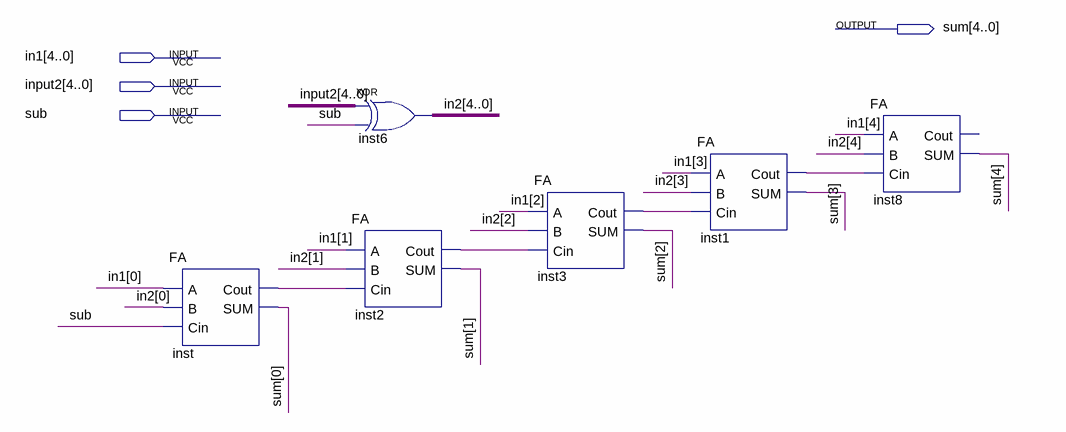
[diagram p0: schematic sheet]
// Quartus schematic 5bit_RCAddSub.bdf as structural Verilog: 6 symbols, 4 pins
module \5bit_RCAddSub  (
  input  [4:0] in1,
  input  [4:0] input2,
  input  sub,
  output [4:0] sum
);

  wire inst1_cout, inst2_cout, inst3_cout, inst_cout;
  wire [4:0] in2;

  FA inst (.A(in1[0]), .B(in2[0]), .Cin(sub), .Cout(inst_cout), .SUM(sum[0]));
  FA inst2 (.A(in1[1]), .B(in2[1]), .Cin(inst_cout), .Cout(inst2_cout), .SUM(sum[1]));
  assign in2 = input2 ^ {5{sub}};  // XOR inst6, 5 bits wide
  FA inst3 (.A(in1[2]), .B(in2[2]), .Cin(inst2_cout), .Cout(inst3_cout), .SUM(sum[2]));
  FA inst1 (.A(in1[3]), .B(in2[3]), .Cin(inst3_cout), .Cout(inst1_cout), .SUM(sum[3]));
  FA inst8 (.A(in1[4]), .B(in2[4]), .Cin(inst1_cout), .SUM(sum[4]));  // open: Cout
endmodule
